# EAGLE board Muntjac (EAGLE 6.5.0)
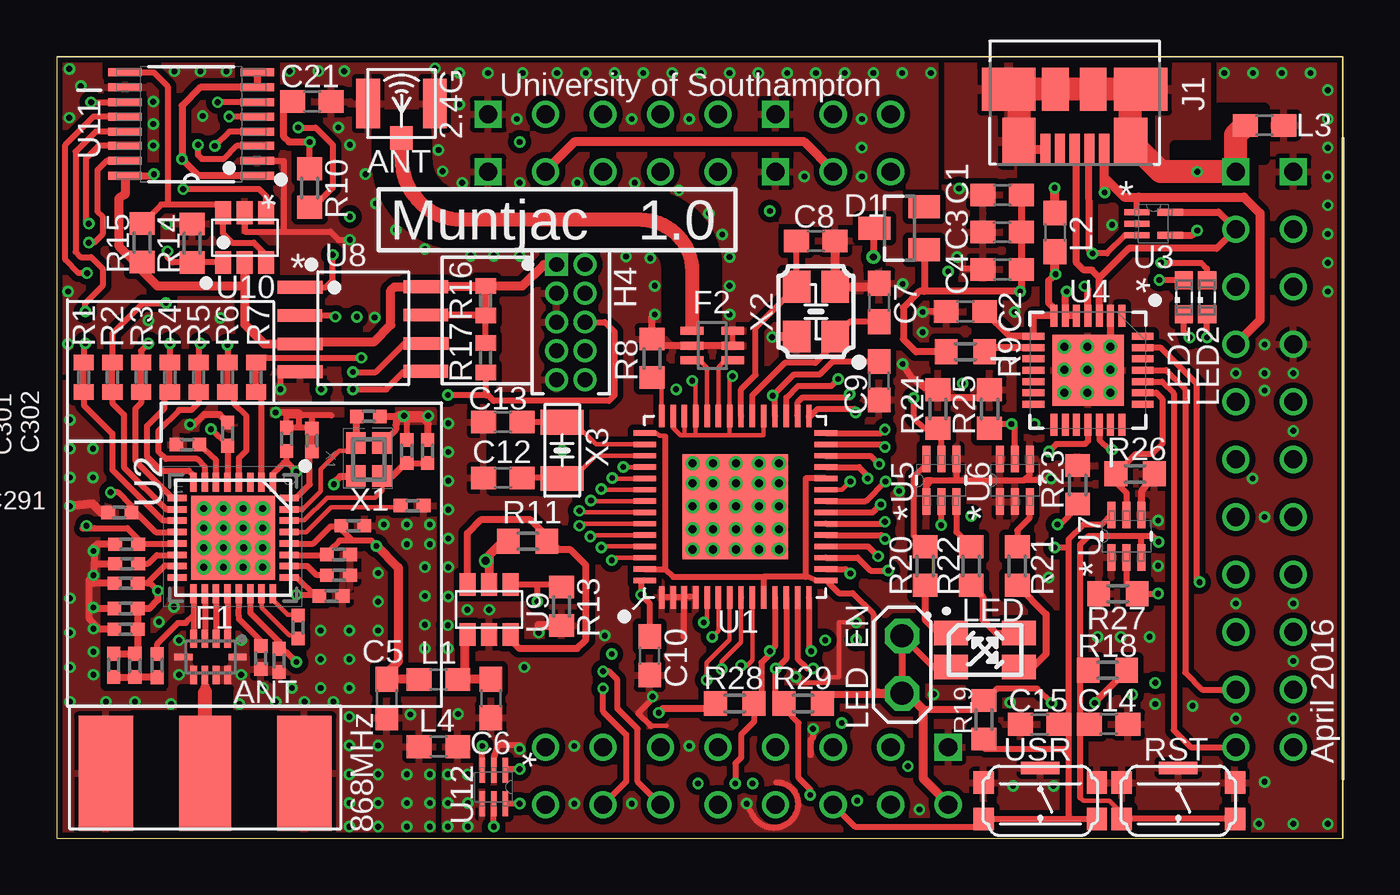
[diagram p6: board, top side]
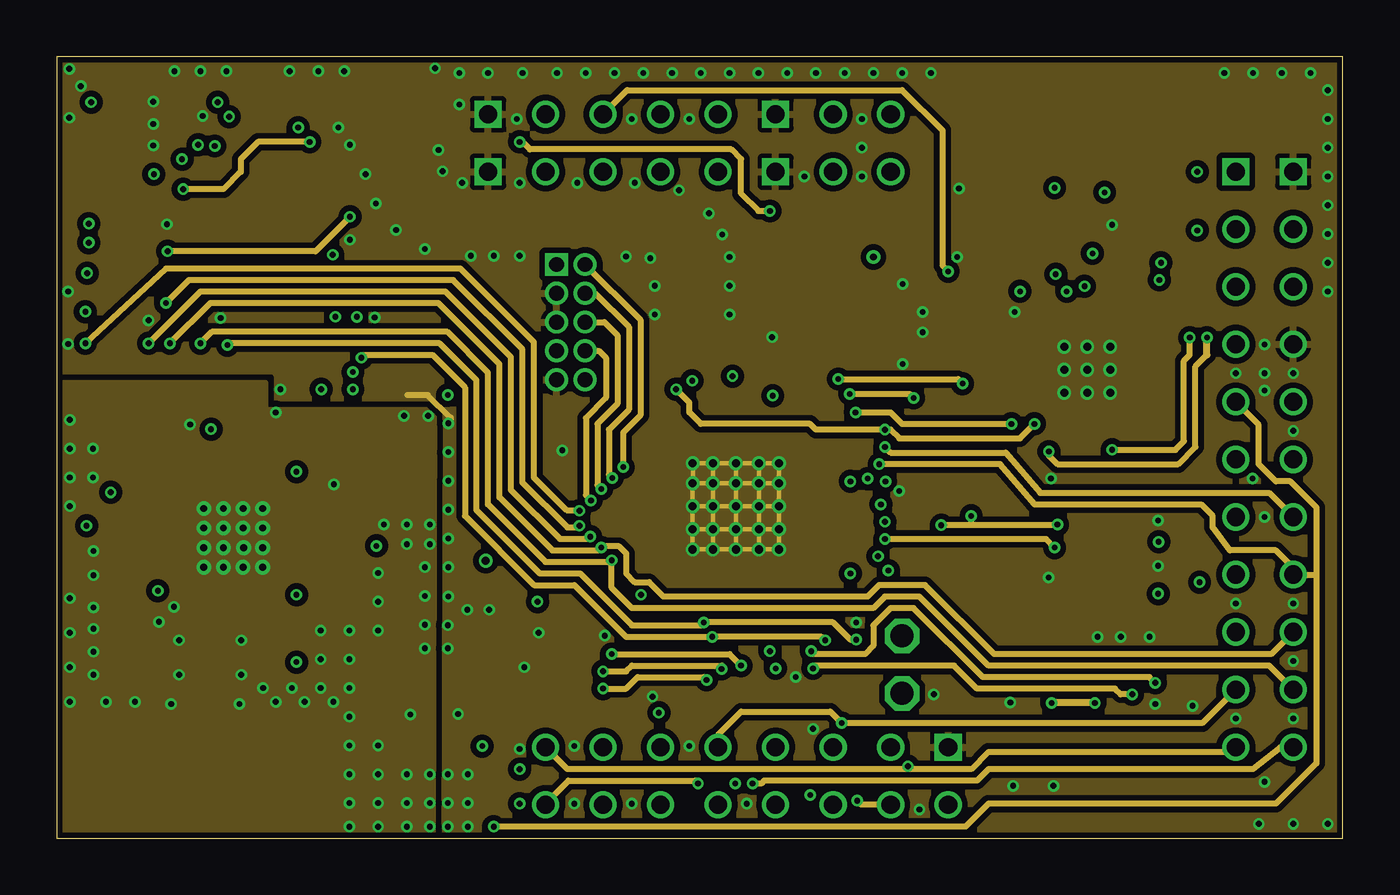
[diagram p7: board, inner layer Route2]
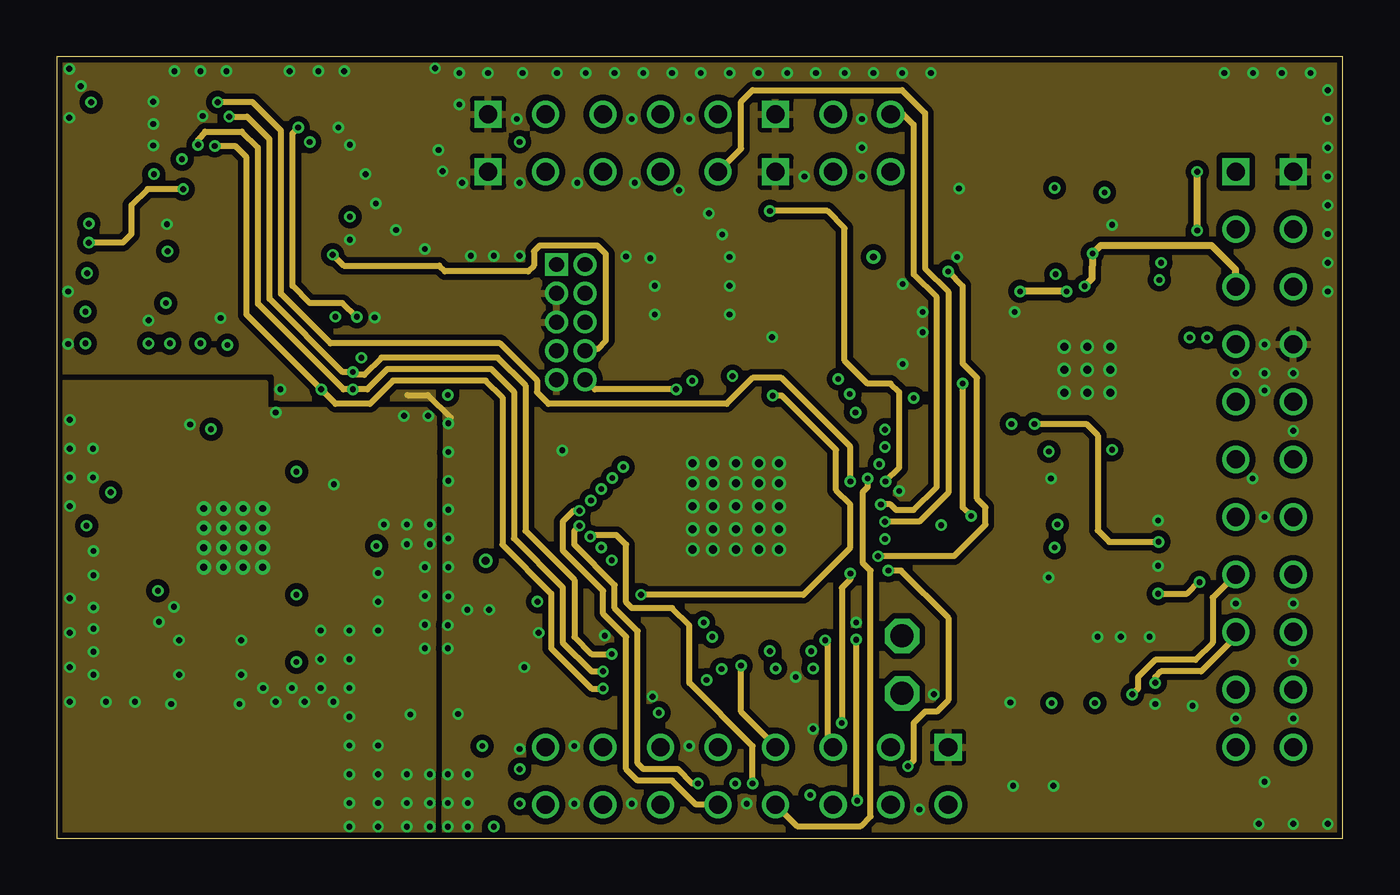
[diagram p8: board, inner layer Route3]
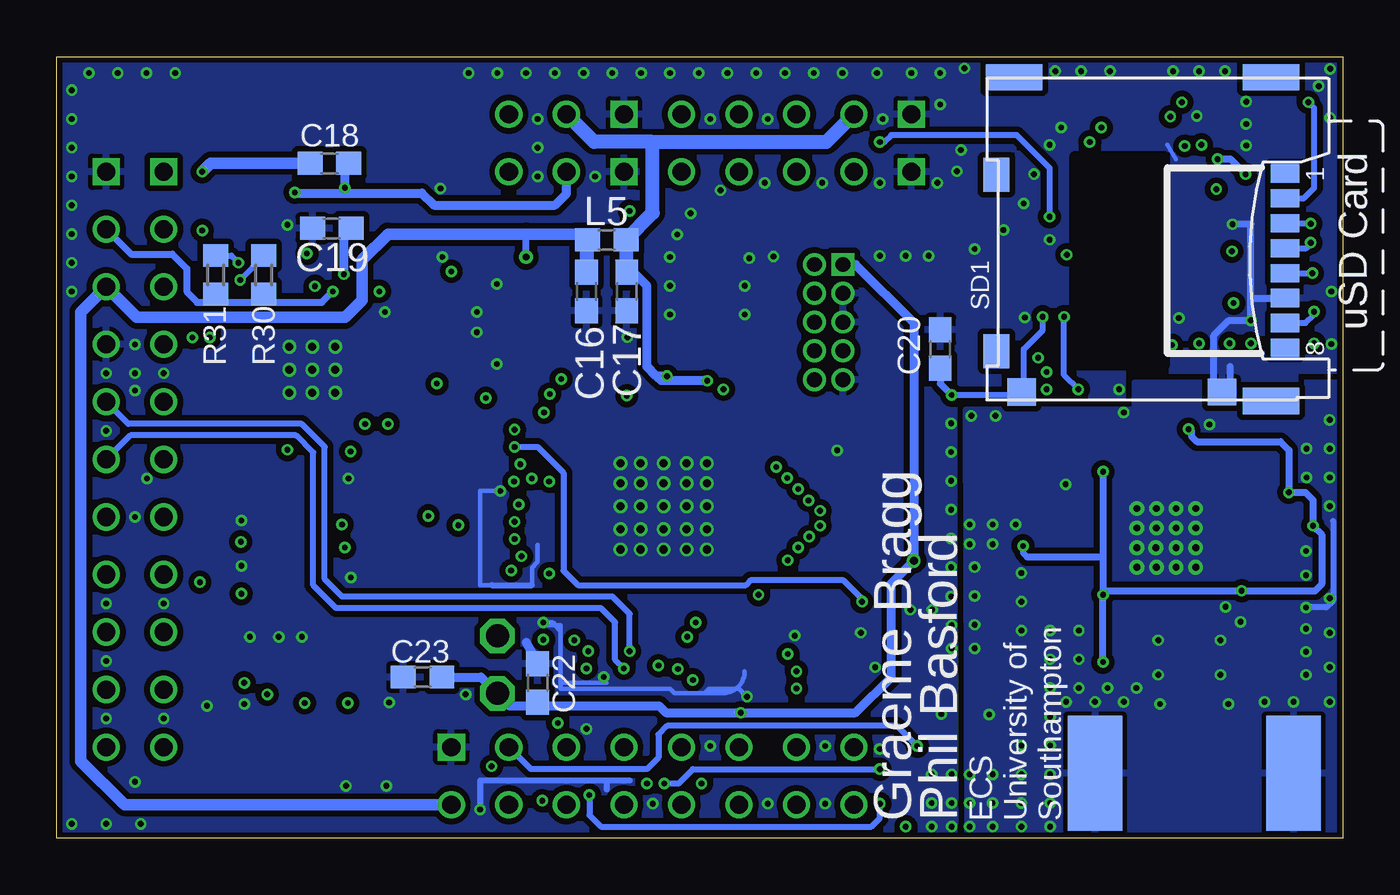
[diagram p9: board, bottom side, seen from below]

Size 56.8 x 34.5 mm. Coordinates in mm from the lower left corner, seen from the top.
Outline: 0,0 56.8,0 56.8,34.5 0,34.5 0,0
Copper layers (1+2*3+16): Top 0.035mm / dielectric 0.36mm / Route2 0.035mm / dielectric 0.71mm / Route3 0.035mm / dielectric 0.36mm / Bottom 0.035mm
Design rules "eC_4Layer_PClass6_BaseCopperO35-I35 *": minimum track width 0.15mm, minimum drill 0.25mm, track to track 0.15mm, track to pad 0.15mm, pad to pad 0.15mm, via to via 0.15mm, smd to smd 0.15mm, copper to edge 0.25mm, drill to drill 0.35mm, minimum pad ring 0.175mm, minimum via ring 0.125mm, stop-mask expansion 0mil, vias tented up to drill 0.45mm, thermal gap 0.2mm
tRestrict: area 2.2,10.7 to 4.6,13.4; area 9.7,14.8 to 11.5,17; area 12.2,15.2 to 14.7,18.3; area 9.4,16.6 to 12.2,18.3; area 14.7,15.2 to 16.8,18; area 5.9,8.4 to 7.7,10.5; area 2.2,6.8 to 3.9,10.7; area 3.9,6.8 to 4.7,8.5; area 42.7,29.2 to 48.3,34.3; area 49.4,28.1 to 52.8,30.6; area 51.3,30 to 53.3,32.2; area 27.2,11.8 to 32.8,17.4; 9 more areas; 5 lines
bRestrict: area 7.9,20.9 to 11.8,30.1

## Footprints (pad centres in the part's own frame; a part is rotated, then mirrored left to right if it is on the bottom)
UFL-HIROSE = smd 1.05 x 2.2: 1 -1.475,0; 2 1.475,0 | smd 1 x 1.05: RF 0,-1.525
JOHNSON_142-0701-806 = smd 2.413 x 5.08: 1 -4.381,-2.54; 2 4.381,-2.54 | smd 2.413 x 5.08 bottom: 3 4.381,-2.54; 4 -4.381,-2.54 | smd 2.286 x 5.08: RF 0,-2.54
C0603 = smd 1.1 x 1: 1 -0.85,0; 2 0.85,0
C0402_SMALL = smd 0.61 x 0.584: 1 -0.536,0; 2 0.485,0
SOT23 = smd 1 x 1.4: 1 -0.95,-1.1; 2 0.95,-1.1; 3 0,1.1
0900PC15J0013 = smd 0.3 x 0.8: 1 0.75,0.8; 2 0.25,0.8; 3 -0.25,0.8; 4 -0.75,0.8; 6 -0.75,-0.8; 7 -0.25,-0.8; 8 0.25,-0.8; 9 0.75,-0.8 | smd 0.8 x 0.3: 5 -1.2,0; 10 1.2,0
2450BM15A0015 = smd 0.35 x 1: 1 0.65,0.9; 2 0,0.9; 3 -0.65,0.9; 4 -0.65,-0.9; 5 0,-0.9; 6 0.65,-0.9
Z1 = drill 0.8 square: A1 17.78,-5.08; A2 17.78,-2.54; A11 30.48,-5.08; A12 30.48,-2.54; B17 50.8,-5.08; B18 53.34,-5.08; C39 38.1,-30.48 | drill 0.8: A3 20.32,-5.08; A4 20.32,-2.54; A5 22.86,-5.08; A6 22.86,-2.54; A7 25.4,-5.08; A8 25.4,-2.54; A9 27.94,-5.08; A10 27.94,-2.54; A13 33.02,-5.08; A14 33.02,-2.54; A15 35.56,-5.08; A16 35.56,-2.54; B19 50.8,-7.62; B20 53.34,-7.62; B21 50.8,-10.16; B22 53.34,-10.16; B23 50.8,-12.7; B24 53.34,-12.7; B25 50.8,-15.24; B26 53.34,-15.24; B27 50.8,-17.78; B28 53.34,-17.78; B29 50.8,-20.32; B30 53.34,-20.32; B31 50.8,-22.86; B32 53.34,-22.86; B33 50.8,-25.4; B34 53.34,-25.4; B35 50.8,-27.94; B36 53.34,-27.94; B37 50.8,-30.48; B40 53.34,-30.48; C40 38.1,-33.02; C41 35.56,-30.48; C42 35.56,-33.02; C43 33.02,-30.48; C44 33.02,-33.02; C45 30.48,-30.48; C46 30.48,-33.02; C47 27.94,-30.48; C48 27.94,-33.02; C49 25.4,-30.48; C50 25.4,-33.02; C51 22.86,-30.48; C52 22.86,-33.02; C53 20.32,-30.48; C54 20.32,-33.02
SAMTEC_FTS-105-01-L-D = drill 0.66 square: 1 -5.08,-1.27 | drill 0.66: 2 -5.08,0; 3 -3.81,-1.27; 4 -3.81,0; 5 -2.54,-1.27; 6 -2.54,0; 7 -1.27,-1.27; 8 -1.27,0; 9 0,-1.27; 10 0,0
MOLEX_47346-0001 = smd 0.45 x 1.38: 1 -1.3,0; 2 -0.65,0; 3 0,0; 4 0.65,0; 5 1.3,0 | smd 1.475 x 2.1: M1 -2.462,-0.36; M2 2.462,-0.36 | smd 2.375 x 1.9: M3 -2.913,-2.66; M6 2.913,-2.66 | smd 1.175 x 1.9: M4 -0.82,-2.66; M5 0.85,-2.66
PLCC-4_3.2X2.8 = smd 1.1 x 1.5: 1 -0.75,-1.5; 2 0.75,-1.5; 3 0.75,1.5; 4 -0.75,1.5
SML0603 = smd 0.8 x 0.8: A 0.75,0; C -0.75,0
1X02 = drill 1.016 octagon: 1 -1.27,0; 2 1.27,0
R0402 = smd 0.7 x 0.9: 1 -0.65,0; 2 0.65,0
R0603 = smd 1 x 1.1: 1 -0.85,0; 2 0.85,0
C&K-KMR-5MM = smd 0.9 x 1: 1 -2.5,-0.8; 2 -2.5,0.8; 4 2.5,0.8; 5 2.5,-0.8 | smd 1.7 x 0.55: 3 0,1.45
MICRO_SD-MOLEX_503182-0853 = smd 0.8 x 1.24: 1 0.4,-0.625; 2 1.5,-0.625; 3 2.6,-0.625; 4 3.7,-0.625; 5 4.8,-0.625; 6 5.9,-0.625; 7 7,-0.625; 8 8.1,-0.625 | smd 1.2 x 1.25: DETECT 10.045,-12.25 | smd 1.15 x 2.5: SHELL0 -3.845,-1.25; SHELL1 -3.845,-12.58; SHELL2 10.445,-1.25 | smd 1.5 x 1.15: SHELL3 0.46,-13.375; SHELL4 8.24,-13.375 | smd 1.16 x 1.25: SWITCH 10.045,-3.4
QFN56 = smd 1 x 0.24: 1 -4,3.25; 2 -4,2.75; 3 -4,2.25; 4 -4,1.75; 5 -4,1.25; 6 -4,0.75; 7 -4,0.25; 8 -4,-0.25; 9 -4,-0.75; 10 -4,-1.25; 11 -4,-1.75; 12 -4,-2.25; 13 -4,-2.75; 14 -4,-3.25; 29 4,-3.25; 30 4,-2.75; 31 4,-2.25; 32 4,-1.75; 33 4,-1.25; 34 4,-0.75; 35 4,-0.25; 36 4,0.25; 37 4,0.75; 38 4,1.25; 39 4,1.75; 40 4,2.25; 41 4,2.75; 42 4,3.25 | smd 0.24 x 1: 15 -3.25,-4; 16 -2.75,-4; 17 -2.25,-4; 18 -1.75,-4; 19 -1.25,-4; 20 -0.75,-4; 21 -0.25,-4; 22 0.25,-4; 23 0.75,-4; 24 1.25,-4; 25 1.75,-4; 26 2.25,-4; 27 2.75,-4; 28 3.25,-4; 43 3.25,4; 44 2.75,4; 45 2.25,4; 46 1.75,4; 47 1.25,4; 48 0.75,4; 49 0.25,4; 50 -0.25,4; 51 -0.75,4; 52 -1.25,4; 53 -1.75,4; 54 -2.25,4; 55 -2.75,4; 56 -3.25,4 | smd 4.65 x 4.65: PAD 0,0
RHM32_3P7X3P7 = smd 0.838 x 0.279: 1 -2.464,1.753; 2 -2.464,1.245; 3 -2.464,0.762; 4 -2.464,0.254; 5 -2.464,-0.254; 6 -2.464,-0.762; 7 -2.464,-1.245; 8 -2.464,-1.753; 17 2.464,-1.753; 18 2.464,-1.245; 19 2.464,-0.762; 20 2.464,-0.254; 21 2.464,0.254; 22 2.464,0.762; 23 2.464,1.245; 24 2.464,1.753 | smd 0.279 x 0.838: 9 -1.753,-2.464; 10 -1.245,-2.464; 11 -0.762,-2.464; 12 -0.254,-2.464; 13 0.254,-2.464; 14 0.762,-2.464; 15 1.245,-2.464; 16 1.753,-2.464; 25 1.753,2.464; 26 1.245,2.464; 27 0.762,2.464; 28 0.254,2.464; 29 -0.254,2.464; 30 -0.762,2.464; 31 -1.245,2.464; 32 -1.753,2.464 | smd 3.708 x 3.708: 33 0,0 | drill 0.305: V 1.295,1.295; V_2 -1.295,-0.432; V_3 -1.295,-1.295; V_4 -1.295,0.432; V_5 -1.295,1.295; V_6 -0.432,-1.295; V_7 -0.432,-0.432; V_8 -0.432,0.432; V_9 -0.432,1.295; V_10 0.432,-1.295; V_11 0.432,-0.432; V_12 0.432,0.457; V_13 0.432,1.295; V_14 1.295,-1.295; V_15 1.295,-0.432; V_16 1.295,0.432
SOT50P160X60-5N = smd 1.118 x 0.254: 1 -0.737,0.508; 2 -0.737,0; 3 -0.737,-0.508 | smd 1.118 x 0.305: 4 0.737,-0.508; 5 0.737,0.508
QFN50P500X500X100-29N = smd 0.965 x 0.305: 1 -2.413,1.499; 2 -2.413,0.991; 3 -2.413,0.508; 4 -2.413,0; 5 -2.413,-0.508; 6 -2.413,-0.991; 7 -2.413,-1.499; 15 2.413,-1.499; 16 2.413,-0.991; 17 2.413,-0.508; 18 2.413,0; 19 2.413,0.508; 20 2.413,0.991; 21 2.413,1.499 | smd 0.305 x 0.965: 8 -1.499,-2.413; 9 -0.991,-2.413; 10 -0.508,-2.413; 11 0,-2.413; 12 0.508,-2.413; 13 0.991,-2.413; 14 1.499,-2.413; 22 1.499,2.413; 23 0.991,2.413; 24 0.508,2.413; 25 0,2.413; 26 -0.508,2.413; 27 -0.991,2.413; 28 -1.499,2.413 | smd 3.15 x 3.15: 29 0,0
SOT65P210X110-6N = smd 1.168 x 0.356: 1 -0.94,0.66; 2 -0.94,0; 3 -0.94,-0.66; 4 0.94,-0.66; 5 0.94,0; 6 0.94,0.66
SOIC8 = smd 1.981 x 0.559: 1 -3.164,1.815; 2 -3.174,0.565; 3 -3.164,-0.685; 4 -3.164,-1.915; 5 2.384,-1.895; 6 2.404,-0.665; 7 2.384,0.585; 8 2.384,1.835
TSOT26 = smd 0.7 x 1: P$1 0.4,-1.9; P$2 1.35,-1.9; P$3 2.3,-1.9; P$4 2.3,0.3; P$5 1.35,0.3; P$6 0.4,0.3
SOP65P640X120-16N = smd 1.473 x 0.356: 1 -2.921,2.286; 2 -2.921,1.626; 3 -2.921,0.965; 4 -2.921,0.33; 5 -2.921,-0.33; 6 -2.921,-0.965; 7 -2.921,-1.626; 8 -2.921,-2.286; 9 2.921,-2.286; 10 2.921,-1.626; 11 2.921,-0.965; 12 2.921,-0.33; 13 2.921,0.33; 14 2.921,0.965; 15 2.921,1.626; 16 2.921,2.286
SOT50P160X60-6N = smd 1.118 x 0.254: 1 -0.737,0.508; 2 -0.737,0; 3 -0.737,-0.508; 4 0.737,-0.508; 5 0.737,0; 6 0.737,0.508
FA-128 = smd 0.95 x 0.85: 1 -0.725,-0.575; 2 0.725,-0.575; 3 0.725,0.575; 4 -0.725,0.575
XTAL-3.2X2.5 = smd 1.4 x 1.2: 1 -1.1,-0.85; 2 1.1,-0.85; 3 1.1,0.85; 4 -1.1,0.85
XTAL-3.2X1.5 = smd 1.092 x 1.905: 1 -1.245,0; 2 1.245,0

## Placement (x,y rotation side)
ANT  UFL  [UFL-HIROSE]  15.23,32.43 0 top
ANT_868  SMA  [JOHNSON_142-0701-806]  6.56,0.32 180 top
C1  4.7uF  [C0603]  41.76,28.4 180 top
C2  1uF  [C0603]  40.13,23.24 0 top
C3  1uF  [C0603]  41.76,26.76 180 top
C4  0.1uF  [C0603]  41.76,25.11 180 top
C5  100nf  [C0603]  14.58,6.17 270 top
C6  100nf  [C0603]  19.18,6.17 270 top
C7  47p  [C0603]  36.32,23.65 270 top
C8  47p  [C0603]  33.53,26.37 180 top
C9  1uF  [C0603]  36.32,20.19 90 top
C10  1uF  [C0603]  26.19,8.05 90 top
C11  47nF  [C0402_SMALL]  10.16,17.63 90 top
C12  47p  [C0603]  19.71,15.9 0 top
C13  47p  [C0603]  19.71,18.36 0 top
C14  1uF  [C0603]  46.46,5.03 0 top
C15  1uF  [C0603]  43.41,5.03 180 top
C16  100nf  [C0603]  33.4,24.13 270 bottom
C17  100nf  [C0603]  31.62,24.13 270 bottom
C18  100nf  [C0603]  44.75,29.79 180 bottom
C19  100nf  [C0603]  44.65,26.92 180 bottom
C20  1uF  [C0603]  17.78,21.59 90 bottom
C21  22uF  [C0603]  11.28,32.51 0 top
C22  1uF  [C0603]  35.56,6.86 270 bottom
C23  100nF  [C0603]  40.64,7.11 0 bottom
C51  47nF  [C0402_SMALL]  7.56,17.86 90 top
C61  220nF  [C0402_SMALL]  5.77,17.37 180 top
C121  47nF  [C0402_SMALL]  2.77,14.38 180 top
C131  47nF  [C0402_SMALL]  3.07,12.98 180 top
C151  47nF  [C0402_SMALL]  3.05,11.25 180 top
C171  10nF  [C0402_SMALL]  3.04,9.22 180 top
C172  100pF  [C0402_SMALL]  3.04,10.14 180 top
C173  33pF  [C0402_SMALL]  2.52,7.65 90 top
C211  10nF  [C0402_SMALL]  9.02,7.95 270 top
C221  47nF  [C0402_SMALL]  9.83,7.82 270 top
C231  1.8nF  [C0402_SMALL]  10.67,9.3 270 top
C251  47nF  [C0402_SMALL]  12.14,10.69 0 top
C261  47nF  [C0402_SMALL]  12.47,11.61 0 top
C271  47nF  [C0402_SMALL]  12.47,12.52 0 top
C281  47nF  [C0402_SMALL]  13.11,13.79 0 top
C291  47nF  [C0402_SMALL]  15.72,14.68 0 top
C301  15pF  [C0402_SMALL]  15.47,17.09 90 top
C302  DNP  [C0402_SMALL]  16.38,17.09 90 top
C311  15pF  [C0402_SMALL]  13.79,18.62 0 top
D1  BAT54S  [SOT23]  37.21,26.92 90 top
F1  0900PC15J0013  [0900PC15J0013]  6.8,8 0 top
F2  BALUN-2.4G  [2450BM15A0015]  28.96,21.74 90 top
H1  Z1  [Z1]  1.27,34.5 0 top
H4  FTS-105-01-L-D  [SAMTEC_FTS-105-01-L-D]  23.34,20.24 270 top
J1  [MOLEX_47346-0001]  44.96,30.4 180 top
L1  BEAD  [C0603]  16.87,7.01 180 top
L2  BEAD  [C0603]  44.08,26.75 270 top
L3  BEAD  [C0603]  53.34,31.46 0 top
L4  BEAD  [C0603]  16.87,4.04 0 top
L5  BEAD  [C0603]  32.51,26.42 180 bottom
L171  10n  [C0402_SMALL]  4.45,7.65 90 top
LED  [PLCC-4_3.2X2.8]  41,8.31 270 top
LED1  [SML0603]  49.78,23.88 90 top
LED2  [SML0603]  50.8,23.88 90 top
LED_EN  [1X02]  37.34,7.66 90 top
R1  DNP  [R0402]  1.2,20.35 270 top
R2  DNP  [R0402]  2.46,20.35 270 top
R3  DNP  [R0402]  3.73,20.35 270 top
R4  DNP  [R0402]  5,20.35 270 top
R5  DNP  [R0402]  6.27,20.35 270 top
R6  DNP  [R0402]  7.54,20.35 270 top
R7  DNP  [R0402]  8.81,20.35 270 top
R8  56k  [R0603]  26.29,21.18 90 top
R9  10k  [R0603]  40.13,21.47 180 top
R10  100k  [R0603]  11.18,28.7 90 top
R11  100K  [R0603]  20.8,13.11 180 top
R12  DNP  [C0402_SMALL]  11.28,17.55 270 top
R13  100K  [R0603]  22.3,10.24 90 top
R14  100K  [R0603]  5.99,26.26 270 top
R15  100K  [R0603]  3.78,26.29 270 top
R16  DNP  [R0402]  18.95,23.72 270 top
R17  DNP  [R0402]  18.95,21.21 270 top
R18  100k  [R0603]  46.41,7.42 0 top
R19  100k  [R0603]  40.94,5.23 90 top
R20  220  [R0603]  38.35,12.01 270 top
R21  220  [R0603]  42.42,12.01 270 top
R22  220  [R0603]  40.39,12.01 270 top
R23  4.7K  [R0603]  45.09,15.6 90 top
R24  4.7K  [R0603]  38.91,18.95 90 top
R25  4.7K  [R0603]  41.2,18.95 90 top
R26  4.7k  [R0603]  47.62,16.08 180 top
R27  4.7k  [R0603]  46.86,10.79 0 top
R28  10k  [R0603]  29.95,5.94 180 top
R29  10k  [R0603]  32.97,5.94 0 top
R30  1K5  [R0603]  47.65,24.87 270 bottom
R31  1K5  [R0603]  49.78,24.87 270 bottom
R141  56K  [C0402_SMALL]  3.12,12.12 0 top
R171  10  [C0402_SMALL]  3.46,7.6 270 top
RST  [C&K-KMR-5MM]  49.53,1.65 0 top
SD1  MICRO_SD-SPI-MOLEX_503182-0853  [MICRO_SD-MOLEX_503182-0853]  1.93,29.74 270 bottom
U1  CC2538  [QFN56]  29.97,14.63 90 top
U2  CC1120_RHM_32  [RHM32_3P7X3P7]  7.8,13.26 270 top
U3  TPD2E001IDRLRQ1  [SOT50P160X60-5N]  48.44,27.13 0 top
U4  CP2103  [QFN50P500X500X100-29N]  45.54,20.66 270 top
U5  BSS138PS  [SOT65P210X110-6N]  39.07,15.8 90 top
U6  BSS138PS  [SOT65P210X110-6N]  42.32,15.8 90 top
U7  BSS138PS  [SOT65P210X110-6N]  47.24,13.34 90 top
U8  M25P16VMN6P  [SOIC8]  13.92,22.5 0 top
U9  DMG6602SVT  [TSOT26]  20.45,9.3 180 top
U10  DMG6602SVT  [TSOT26]  6.96,27.3 0 top
U11  SN74AVC4T774PW  [SOP65P640X120-16N]  5.94,31.52 180 top
U12  TMP102AIDRLT  [SOT50P160X60-6N]  19.3,2.26 270 top
USR  [C&K-KMR-5MM]  43.43,1.65 0 top
X1  FA-128  [FA-128]  13.79,16.71 270 top
X2  32MHz  [XTAL-3.2X2.5]  33.53,23.24 90 top
X3  32.768K  [XTAL-3.2X1.5]  22.33,17.12 270 top

## Tracks (layer width: path | path; a pad name or v marks a point on that pad's centre or on a via)
2.4G
  Top 0.254: 28.07,22.53 28.07,22.4 arc-90 F2.1
  Top 0.305: F2.1
  Top 0.61: 28.07,22.53 28.07,25.02 arc90 25.78,27.3 17.91,27.3 arc-90 15.24,29.97 15.24,30.89 ANT.RF
32K_Q1
  Top 0.203: X3.2 22.78,15.88 23.8,16.89 U1.45 arc-90 U1.45
  Top 0.254: X3.2 22.3,15.9 C12.2
32K_Q2
  Top 0.203: U1.44 23.82,17.38 22.84,18.36 X3.1
  Top 0.254: X3.1 C13.2
32M_Q1
  Top 0.254: U1.34 30.72,19.55 32.16,20.98 33.5,20.98 34.38,21.86 X2.1 35.03,22.8 C7.2
32M_Q2
  Top 0.203: U1.35
  Top 0.254: U1.35 30.23,19.81 30.86,20.45 30.86,22.52 X2.3 C8.2
+3V3  (via drill 0.25, 0.3 pad 0.61, 0.36)
  Top 0.203: U1.43 26.49,17.88 26.62,17.75 26.85,17.75 arc-90 26.87,17.73 | U1.15 34.02,11.33 34.09,11.28
  Top 0.229: U1.15 33.5,11.38 33.07,11.58
  Top 0.254: U1.24 33.07,15.88 33.07,11.58 33.07,11.53 31.22,11.53 | 31.22,11.53 U1.10 | 34.09,11.28 34.54,10.82 35.15,10.82 36.07,9.91 36.07,6.39 | 37.34,8.94 38.72,7.56 LED.2 | v43.94,5.97 43.31,6.6 41.53,6.6 41.01,6.08 R19.2 | R15.2 3.91,25.55 | 8.31,25.73 U10.P$2 | R17.1 R16.2 | 26.87,17.73 26.87,11.88 | 31.22,11.53 27.22,11.53 26.87,11.88 | U1.55 26.87,11.88
  Top 0.305: U9.P$2 19.1,12.29 v18.95,12.24 19.1,12.24 | R11.2 19.61,13.01 | 37.34,8.94 LED_EN.1 | R19.2 40.53,5.66 38.28,5.66 | R18.2 45.85,6.01 v45.85,5.97 | R28.2 28.87,5.71 26.77,5.71 v26.59,5.54 | R29.2 arc90 33.92,5.84 33.91,5.84 33.93,6.34 33.93,6.35 36.03,6.35 arc90 36.07,6.39 | 36.07,26.88 v36.07,25.65 | 37.54,6.4 37.53,6.39 LED_EN.1 | LED_EN.1 | 18.56,24.34 R16.1 R16.2 18.36,23.09 U8.7 | U11.8 U11.7 6.35,33.15 5.54,32.33 v5.54,29.97 6.27,29.23 U11.1 | 11.56,21.89 11.43,21.82 U8.3 | 3.02,29.21 U11.16 4.34,29.23 v4.29,29.31
  Top 0.406: 19.61,13.01 19.1,12.49 U9.P$2 | H1.C40 39.41,1.48 38.28,2.62 38.28,5.66 37.54,6.4 | 36.27,6.4 LED_EN.1 | LED_EN.2 | LED_EN.2 37.34,8.94 | 18.56,24.34 U8.8 14.92,24.34 14.76,24.18 14.76,22.66 13.99,21.89 11.56,21.89 | H4.1 21.51,25.32 20.56,24.37 R16.1 | R15.2 3.44,25.44 2.74,26.14 2.74,28.25 3.02,28.42 3.02,29.21 | U10.P$2 8.31,24.38 | 8.31,24.38 8.31,22.68 9.17,21.82 U8.3 | 3.91,25.55 3.66,25.17 4.45,24.38 8.31,24.38 | 36.07,6.39 LED_EN.1
  Top 0.508: D1.3 36.07,26.88
  Route2 0.305: v45.85,5.97 v43.94,5.97
  Bottom 0.203: C22.2 35.56,5.84
  Bottom 0.305: v36.07,25.65 36.07,26.67 | LED_EN.1 | LED_EN.1 | v4.29,29.31 4.95,29.97 v5.54,29.97
  Bottom 0.406: LED_EN.1 36.78,5.84 35.56,5.84 30.2,5.84 29.9,5.54 v26.59,5.54 21.51,5.54 19.94,7.11 19.94,11.25 v18.95,12.24 18.95,22.76 21.51,25.32 H4.1 | L5.2 33.4,26.42 | C23.2 38.06,7.11 LED_EN.1
  Bottom 0.508: H1.C40 53.8,1.48 55.73,3.4 55.73,23.22 H1.B22 53.26,22.99 44.07,22.99 43.31,23.75 43.31,25.53 42.16,26.67 36.07,26.67 33.62,26.67 L5.2
  Bottom 0.61: 33.4,26.42 C16.1
+3V3_ANALOGUE  (via drill 0.25)
  Top 0.203: U1.33 31.22,17.78 29.72,17.78 | 29.72,17.78 28.22,17.78 | 28.22,17.78 U1.39 28.22,20.04 arc90 v28.07,20.19 | 29.72,17.78 U1.36 | U1.41 27.22,18.12 27.56,17.78 27.69,17.78 | 27.69,17.78 28.22,17.78 | U1.40 27.72,17.82 27.69,17.78 | v29.84,20.4 29.72,20.27 U1.36
  Bottom 0.406: 31.66,25.02 arc-90 C17.1 31.33,24.98 30.73,24.38 30.73,20.83 30.3,20.4 | v28.07,20.19 30.1,20.19 30.3,20.4 | v29.84,20.4 30.3,20.4
  Bottom 0.61: 31.66,25.02 L5.1 30.48,27.6 30.48,30.73 | 30.48,30.73 33.06,30.73 H1.A14 | 30.48,30.73 22.82,30.73 H1.A4
+3V3_SERIAL  (via drill 0.25)
  Top 0.305: C1.1 42.61,26.89 C3.1 42.6,25.49 C4.1 42.61,24.14 v42.55,24.14 38.31,24.14 | U4.5 U4.6 44.55,24.16 v44.6,24.14 | R9.2 37.95,21.47 37.39,22.03 37.39,23.42 38.11,24.14 38.31,24.14 | D1.1 38.31,24.14
  Route3 0.305: v44.6,24.14 v42.55,24.14
  Bottom 0.254: R31.2 49.78,23.65 | R30.2 47.5,23.86 47.5,23.65
  Bottom 0.305: H1.B20 53.51,25.78 51.69,25.78 51.05,25.15 51.05,24.13 50.6,23.65 49.78,23.65 47.5,23.65 45.09,23.65 v44.6,24.14
+5V  (via drill 0.25)
  Top 0.305: C2.2 42.1,22.16 U4.8 43.13,23.07 U4.7 44.04,23.4 43.81,23.62 43.81,24.61 44.1,24.89 v44.12,24.89
  Top 0.406: v44.12,24.89 44.08,24.9 L2.2
  Bottom 0.406: C19.1 44.12,26.61 v44.12,24.89
+5V_USB  (via drill 0.25)
  Top 0.254: U3.1 47.7,28.23 47.78,28.3
  Top 0.305: 46.26,29.19 46.25,29.19 46.25,29.22 | 46.25,28.61 46.25,28.48 46.26,28.48 v46.28,28.5 | L2.1 44.07,27.61
  Top 0.406: J1.1 46.26,29.19 47.14,28.3 47.78,28.3 52.43,28.3 53.14,27.59 53.14,22.87 H1.B23 | v44.07,28.71 44.07,27.61 | 46.25,29.22 46.25,28.61 | H1.A3 21.59,29.46 22.86,30.73 33.02,30.73 34.29,29.46 H1.A13
  Bottom 0.305: v46.28,28.5 46.15,28.48 | 44.07,29.7 C18.1
  Bottom 0.406: H1.A13 34.29,28.45 34.8,27.94 40.13,27.94 40.67,28.48 44.07,28.48 | 46.15,28.48 44.07,28.48 | 44.07,28.48 v44.07,28.71 44.07,29.7
ADC_SENSORS_ADC1  (via drill 0.25)
  Top 0.254: U1.21 36.05,14.38 v36.4,14.73
  Route3 0.254: v36.4,14.73 36.83,14.73 37.08,14.48 37.85,14.48 38.86,15.49 38.86,23.88 37.85,24.89 37.85,31.5 37.38,31.96 H1.A16
ADC_SENSORS_ADC2  (via drill 0.25)
  Top 0.254: U1.20 36.49,13.88 v36.58,13.97
  Route3 0.254: H1.A9 30.23,30.44 30.23,32.51 30.73,33.02 37.34,33.02 38.35,32 38.35,25.15 39.37,24.13 39.37,15.24 38.1,13.97 v36.58,13.97
ADC_SENSORS_ADC3  (via drill 0.25)
  Top 0.254: U1.18 35.84,12.88 v36.27,12.45
  Route2 0.254: H1.A6 25.19,33.02 37.34,33.02 39.12,31.24 39.12,25.27 v39.37,25.02
  Route3 0.254: v39.37,25.02 40.01,24.38 40.01,20.95 40.64,20.32 40.64,14.99 41.02,14.61 41.02,13.84 39.62,12.45 v36.27,12.45
BSL_DTR  (via drill 0.25)
  Top 0.254: v48.64,10.79 R27.2 47.24,11.26 U7.2 | v50.47,11.3 50.34,11.3 50.34,20.07 48.76,21.65 U4.27
  Route3 0.254: v48.64,10.79 49.91,10.79 50.47,11.35 v50.47,11.3
BSL_RTS
  Top 0.254: U4.23 48.56,19.67 48.82,19.41 48.82,17.4 48.39,16.97 47.66,16.97 R26.2 46.77,15.71 47.24,15.24 U7.5
CC2538_NRESET  (via drill 0.25)
  Top 0.203: 45.19,1.8 45.34,1.65 46.48,1.65 47.03,1.1
  Top 0.254: U7.3 47.9,13.34 | 47.9,13.34 45.56,13.34 45.19,12.96 45.19,7.37 | 45.19,7.37 45.19,5.05 | 45.19,5.05 45.19,1.8 | 47.03,1.1 RST.1 RST.5 52.25,0.64 | C14.1 45.19,5.05 | U1.28 36.42,17.88 v36.58,18.03 | v48.67,13.08 48.39,13.34 47.9,13.34 | R18.1 45.51,7.37 45.19,7.37
  Route2 0.254: v27.36,19.81 27.94,19.23 27.94,18.8 28.45,18.29 33.27,18.29 33.53,18.03 v36.58,18.03 36.83,18.03 37.21,17.65 42.55,17.65 v43.18,18.29
  Route3 0.254: v27.36,19.81 23.77,19.81 H4.10 | v43.18,18.29 45.47,18.29 45.97,17.78 45.97,13.59 46.48,13.08 v48.67,13.08
DCOUPL  (via drill 0.25)
  Top 0.254: U1.32 31.72,19.63 | U1.56 25.81,11.37 v25.81,10.74 26.19,10.36 C10.2 | C9.2 36.44,21.06 34.29,21.06 33.71,20.47 32.56,20.47 31.72,19.63 | 31.72,19.63 v31.62,19.53
  Route3 0.254: v25.81,10.74 32.97,10.74 35.05,12.82 35.05,14.73 34.42,15.37 34.42,17.14 32.03,19.53 v31.62,19.53
GND  (via drill 0.25, 0.36)
  Top 0.203: F2.5 F2.6 | v29.99,14.65 U1.PAD | v35.31,9.53 34.54,9.53 34.54,7.11 34.04,7.11 34.04,6.86 32.77,6.86 32.77,7.11 | 26.92,4.95 26.24,4.95
  Top 0.254: U5.4 39.73,15.8 | 38.66,15.8 38.41,15.54 U5.1 | 38.66,15.8 39.73,15.8 | 38.66,15.8 38.38,15.8 38.38,15.29 | 39.73,15.8 42.72,15.8 | 42.72,15.8 42.98,16.05 U6.4 | 43.92,15.8 42.72,15.8 | R14.1 6.36,26.75 | U10.P$5 8.31,26.77 10.03,26.77 | U8.4 9.88,20.59 v9.88,19.81 | U1.1 26.76,10.67 27.69,10.67 | 28.19,10.67 27.69,10.67 | 27.69,10.67 27.69,8.89 | 10.03,26.77 12.09,26.77 12.45,26.42 v12.95,26.42 | U11.2 10.03,29.9 10.03,26.77 | v20.45,3.94 20.45,4.12 19.56,4.12 19.43,3.94 19.3,3.56 U12.2 | 31.77,2.46 31.8,2.46 arc-90 32.74,1.52 arc-152 30.73,1.02 arc-4 v30.48,1.52 | 40.01,25.15 40.89,25.15 40.91,25.13 C4.2 | 26.24,4.95 25.68,5.51 26.31,6.15 v26.31,6.25 | 33.27,3.68 33.27,4.32 33.4,4.45 v33.4,4.83 | 33.3,4.32 33.3,3.68
  Top 0.305: F2.5 F2.2 | U4.2 v46.53,21.69 | 46.53,21.65 U4.29 | v44.49,21.7 v44.49,20.68 | v44.49,20.68 v44.49,19.67 v45.51,19.67 v46.53,19.67 | v45.51,20.68 v44.49,20.68 | v45.51,20.68 45.51,19.81 45.47,19.77 | 45.47,19.51 45.47,19.77 | 45.47,19.77 45.61,19.77 v46.53,20.68 | v45.51,20.68 v45.51,21.7 45.56,21.65 46.53,21.65 | 46.53,21.65 v46.53,21.69 | v46.53,21.69 v46.53,21.7 | C2.1 38.17,23.27 v38.25,23.22 | R26.1 47.9,15.3 U7.4 | R25.2 40.83,19.43 39.28,19.43 R24.2 38.33,19.89 38.1,20.07 | 38.1,20.07 37.74,20.34 v37.36,20.94 | 38.61,20.07 38.1,20.07 | 28.04,21.74 26.29,21.74 26.29,23.01
  Top 0.406: C8.1 X2.2 36.17,24.34 arc90 C7.1 | X2.4 31.61,22.14 arc90 v31.59,22.12 | R13.1 21.29,9.39 v21.29,9.07
  Route2 0.203: v28.09,16.55 v28.98,16.55 | v28.98,16.55 v29.99,16.55 | v29.99,16.55 v31.01,16.55 | v31.01,16.55 v31.9,16.55 v31.9,15.66 | v31.9,15.66 v31.9,14.65 | v31.9,14.65 v31.9,13.63 | v31.9,13.63 v31.9,12.74 v31.01,12.74 | v31.01,12.74 v29.99,12.74 | v29.99,12.74 v28.98,12.74 | v28.98,12.74 v28.09,12.74 v28.09,13.63 | v28.09,13.63 v28.09,14.65 | v28.09,14.65 v28.09,15.66 v31.9,15.66 | v28.09,14.65 v31.9,14.65 | v28.09,13.63 v31.9,13.63 | v29.99,12.74 v29.99,15.66 v29.99,16.55 | v28.98,12.74 v28.98,15.66 v28.98,16.55 | v31.01,12.74 v31.01,15.66 v31.01,16.55 | v29.99,16.55 v28.09,16.55 v28.09,15.67
  Route2 0.254: 15.49,19.56 16.38,19.56 17.4,18.57 17.4,18.41
  Route3 0.254: 15.49,19.56 16.38,19.56 17.4,18.57
  Bottom 0.203: 35.81,11.18 35.81,11.94 35.56,12.19 35.56,12.95 | 28.19,6.4 29.52,6.4 29.72,6.6 34.54,6.6 34.54,6.86 | 28.19,6.4 27.99,6.6 26.67,6.6 26.36,6.27 v26.31,6.25 | 34.8,9.4 35.18,9.4 v35.31,9.53 34.92,9.53 arc90 34.8,9.4 | 34.8,9.4 34.54,9.14 | 34.54,9.14 34.54,6.86 | 28.19,6.4 27.38,6.4 arc-90 26.42,7.37 | 34.8,9.4 34.54,9.4 34.54,9.14 | 34.54,6.86 32.77,6.86 | 32.51,6.86 32.77,6.86 | 32.77,6.86 32.77,7.11 | 37.21,15.34 38.1,15.34 38.1,11.18 37.59,11.18 | 7.75,30.61 7.37,29.97
  Bottom 0.254: 37.59,11.18 35.81,11.18 | 31.5,2.54 32.51,2.54 | 32.51,2.54 38.1,2.54 v38.1,1.27 | 32.51,2.54 32.51,2.16
  Bottom 0.305: 5.69,19.7 5.69,22.2 5.03,22.86 v4.06,22.86 4.06,23.88 | SD1.6 4.03,23.84 arc90 4.06,23.88 | 4.06,23.88 4.06,27.1 v4.88,27.1 | 4.98,19.56 4.98,20.83
  Bottom 0.406: 5.59,19.7 5.69,19.7 | 36.07,8.64 35.56,7.75
  Bottom 0.61: SD1.SWITCH 5.59,19.7
  other vias: 17.73,5.49 17.27,1.55 19.1,10.08 28.98,13.63 28.98,14.65 31.01,14.65 31.01,13.63 29.99,13.63 38.25,22.33 48.63,14.03 48.63,12.02 20.65,7.54 18.14,10.08 43.81,11.51 43.91,15.88 42.11,5.99 42.24,2.31 42.31,23.22 20.45,28.93 22.99,28.93 25.53,28.93 16.87,30.38 27.48,28.6 17.04,29.44 26.42,24.38 26.42,23.11 26.21,25.6 25.15,25.68 20.45,25.7 19.05,33.78 22.1,33.78 24.64,33.78 27.18,33.78 29.72,33.78 32.26,33.78 34.8,33.78 37.34,33.78 38.61,33.78 36.07,33.78 33.53,33.78 30.99,33.78 28.45,33.78 25.91,33.78 23.37,33.78 20.57,33.78 12.95,30.61 51.56,33.78 52.83,33.78 54.1,33.78 55.37,33.78 46.61,27.08 56.13,26.67 56.13,27.94 56.13,29.21 56.13,30.48 56.13,25.4 56.13,31.75 56.13,33.02 35.56,31.75 35.56,30.48 35.56,29.21 33.02,29.21 25.4,31.75 27.94,31.75 20.32,31.75 25.4,1.52 22.86,1.52 22.86,4.06 56.13,0.64 53.09,0.64 54.61,0.64 50.16,5.84 48.26,8.89 46.99,8.89 45.97,8.89 52.07,20.52 53.34,20.52 54.61,20.52 53.34,21.79 53.34,19.76 54.61,17.98 53.34,14.17 54.61,10.36 52.07,10.36 54.61,7.82 52.07,5.28 54.61,5.28 48.51,5.92 39.77,25.66 39.85,28.68 29.72,23.11 29.72,24.38 29.72,25.65 28.8,27.58 29.39,26.64 16.71,33.99 17.78,32.38 12.7,33.86 14.1,28.02 16.26,26.01 38.73,6.35 1.07,33.2 4.27,31.52 4.27,30.58 4.27,32.51 6.45,31.88 17.27,2.82 17.27,0.51 18.16,2.82 18.16,0.51 18.16,1.55 14.99,26.85 18.29,25.7 19.3,25.7 24.21,8.94 37.2,15.32 22.33,17.12 32.64,7.11 0.51,24.13 0.51,21.82 7.24,22.96 14.05,22.99 27.94,4.06 44.02,2.31 53.34,2.49 52.81,15.88 56.13,24.13 17.78,33.78 10.29,33.86 11.56,33.86 0.56,33.96 0.56,31.8 7.49,33.86 5.21,33.86 6.35,33.86 17.3,11.96 17.27,8.38 17.27,9.4 17.3,10.67 17.3,13.23 17.3,14.5 17.3,15.77 17.3,17.04 17.3,18.31 37.36,24.47 13.64,29.31 17.91,28.93 12.45,31.37
  pour Bottom (isolate 0.254, rank 4): -10.16,43.69 -10.16,-2.29 62.99,-2.29 62.99,43.69 -9.91,43.69
  pour Route2 (isolate 0.254, rank 4): -12.7,41.15 -12.7,-4.83 60.45,-4.83 60.45,41.15 -12.45,41.15
  pour Top (isolate 0.254, rank 4): -13.97,39.88 -13.97,-6.1 59.18,-6.1 59.18,39.88 -13.72,39.88
  pour Route3 (isolate 0.254, rank 4): -11.43,42.42 -11.43,-3.56 61.72,-3.56 61.72,42.42 -11.18,42.42
  pour Top (isolate 0.254): 30.23,4.06 30.23,1.78 33.02,1.78 33.02,2.79 31.75,4.06
GNDA  (via drill 0.25)
  Top 0.305: U3.4 50.16,26.62 v50.37,26.83 | J1.M2
  Top 0.406: J1.5 42.85,30.4 arc-90 J1.M2
  Top 1.016: J1.M2 42.49,32.61 J1.M6 J1.M5 J1.M4 J1.M3 47.42,32.61 J1.M1 48.76,29.42 v50.37,29.42 H1.B17 52.07,31.04 L3.1
  Route3 0.305: v50.37,26.83 v50.37,29.42
  Bottom 0.508: C18.2 49.99,29.79 v50.37,29.42
  pour Top (isolate 0.254): 39.37,29.21 50.8,29.21 50.8,35.56 39.37,35.56
I2C_SCL  (via drill 0.25)
  Top 0.254: U1.11 31.72,8.48 v31.5,8.26 31.5,8.13 31.11,7.75 31.11,5.84 R28.1 30.8,5.14 30.23,4.57 30.23,3.56 29.97,3.3 v29.97,2.41 | v20.45,3.05 19.86,3.05 U12.1
  Bottom 0.254: v31.5,8.26 31.5,9.91 32.26,10.67 44.2,10.67 44.96,11.43 44.96,17.27 45.97,18.29 53.64,18.29 H1.B26 | v20.45,3.05 28.7,3.05 29.34,2.41 v29.97,2.41
I2C_SDA  (via drill 0.25)
  Top 0.254: U1.12 32.22,7.91 31.8,7.49 v31.75,7.49 | 31.66,7.41 v31.75,7.49 | v31.75,7.49 31.75,5.84 R29.1 32.12,5.73 32.77,5.08 32.77,2.67 33.27,2.16 v33.27,1.91 | v20.45,1.52 U12.6
  Bottom 0.254: v31.75,7.49 32.13,7.87 32.13,9.53 32.77,10.16 44.45,10.16 45.47,11.18 45.47,17.02 46.23,17.78 53.55,17.78 H1.B28 | v33.27,1.91 33.27,1.02 32.77,0.51 20.83,0.51 20.45,0.89 v20.45,1.52
JTAG_TCK  (via drill 0.25)
  Top 0.203: U1.47 24.54,15.88 arc-90 v24.54,15.9
  Route2 0.254: H4.4 23.79,24.05 25.27,22.57 25.27,18.92 24.38,18.03 24.38,16.05 v24.54,15.9
JTAG_TDI/FLASH_SPI_CSN  (via drill 0.25)
  Top 0.203: U1.49 23.65,14.88
  Top 0.254: 23.65,14.88 v23.6,14.91 | U8.1 11.87,24.32 12.19,24.64 v12.19,25.76
  Route2 0.254: H4.8 23.95,21.51 24.26,21.21 24.26,19.43 23.37,18.54 23.37,15.14 v23.6,14.91
  Route3 0.254: H4.8 23.42,21.59 23.88,21.59 24.26,21.97 24.26,25.78 23.88,26.16 21.34,26.16 21.08,25.91 21.08,25.27 20.83,25.02 17.14,25.02 16.89,25.27 12.68,25.27 v12.19,25.76
JTAG_TDO/SD_PRESENCE  (via drill 0.25)
  Top 0.203: U1.48 24.13,15.38
  Top 0.254: 24.13,15.38 v24.05,15.42 | H4.6 24.21,22.78 24.64,22.35 24.64,19.56 24.38,19.3 19.3,19.3 19.05,19.56 18.95,19.56 | 18.95,19.56 v17.27,19.56 | R17.2 18.95,19.56 | v10.67,31.37 11.43,31.37 12.19,30.61 12.19,28.7 11.68,28.19 11.52,28.19 R10.1
  Route2 0.254: H4.6 24.19,22.78 24.77,22.21 24.77,19.18 23.88,18.29 23.88,15.6 v24.05,15.42
  Route3 0.254: v13.26,23.01 12.62,23.62 11.18,23.62 10.41,24.38 10.41,31.11 v10.67,31.37
  Bottom 0.254: v17.27,19.56 14.29,19.56 SD1.DETECT 14.19,19.68 14.1,19.94 14.1,21.59 13.26,22.43 v13.26,23.01
  Bottom 0.305: C20.1 17.78,20.07 v17.27,19.56
JTAG_TMS  (via drill 0.25)
  Top 0.203: U1.46 v25.02,16.38
  Top 0.254: v25.02,16.38
  Route2 0.254: H4.2 25.78,22.89 25.78,18.67 25.02,17.91 v25.02,16.38
LEDS_BLUE  (via drill 0.25)
  Top 0.254: U1.29 33.22,18.57 33.6,18.95 35.26,18.95 v35.28,18.8 | R25.1 41.39,18.29 v42.16,18.29 42.32,18.14 U6.5
  Route2 0.254: v35.28,18.8 36.83,18.8 37.34,18.29 v42.16,18.29
LEDS_GREEN  (via drill 0.25)
  Top 0.254: U1.30 32.72,19.23 32.94,19.46 35.03,19.46 v35.03,19.61 | U5.5 39.06,17.95 R24.1 38.29,18.1 37.85,18.54 v37.85,19.43
  Route2 0.254: v35.03,19.61 37.67,19.61 v37.85,19.43
LEDS_RED  (via drill 0.25)
  Top 0.254: U1.31 32.22,19.45 32.74,19.96 34.21,19.96 v34.52,20.27 | v39.06,13.82 U5.2 | R23.1 45.09,14.61 44.32,13.84 v44.2,13.84
  Route2 0.254: v34.52,20.27 39.8,20.27 v40.01,20.07 | 40.39,14.12 v40.39,14.22 40.39,13.82 | 40.39,13.82 v39.06,13.82 | v44.2,13.84 arc90 44.09,13.82 40.39,13.82
  Route3 0.254: v40.01,20.07 40.01,14.61 v40.39,14.22
MEM_VCC  (via drill 0.25)
  Top 0.254: U11.15 2.21,29.9 1.8,29.49 1.8,27.66 2.03,27.43 2.03,26.67 1.65,26.29 v1.42,26.29 | U10.P$4 9.26,28.33 8.94,28.65 v5.59,28.65 | R10.2 v11.18,30.73
  Top 0.305: C21.1 10.01,32.51 10.01,30.99 10.26,30.73 v11.18,30.73
  Route2 0.254: v11.18,30.73 8.89,30.73 8.13,29.97 8.13,29.41 7.37,28.65 v5.59,28.65
  Route3 0.254: v5.59,28.65 4.01,28.65 3.3,27.94 3.3,26.67 2.92,26.29 v1.42,26.29
  Bottom 0.254: SD1.4 1.61,26.04 1.42,26.23 v1.42,26.29
N$1
  Top 0.203: 9.55,10.51 10.21,9.86 10.67,9.86
  Top 0.254: 9.55,10.51 U2.24 | 10.67,9.86 C231.1
N$2
  Top 0.203: 10.67,8.84 10.54,8.84 | 9.05,10.51 9.06,10.3 9.06,10.18 10.27,8.97 10.51,8.97 C231.2
  Top 0.254: 9.05,10.51 9.04,10.52 U2.23 | C231.2 10.64,8.84 10.54,8.84
N$3
  Top 0.254: U2.21 8.05,10.46 8.05,9.81 8.05,9.68 8.99,8.73 C211.1
N$4
  Top 0.254: U2.6 7.04,16.7 C61.1
N$5
  Top 0.254: C261.1 11.48,11.61 11.07,12.01 U2.26
N$6
  Top 0.203: 13.22,17.41 13.22,17.09 12.47,17.09 11.66,16.28 11.66,15.32 10.86,14.52 10.82,14.52
  Top 0.254: 10.82,14.52 10.56,14.5 U2.31 | X1.1 13.26,17.44 13.26,17.5 | C311.1 13.26,18.59
  Top 0.304: 13.22,17.41 13.26,17.41 13.26,17.5 13.26,18.59
N$7
  Top 0.203: 10.54,14.03 10.57,14.03 10.94,14.03 11.94,15.04 14.07,15.04 14.4,15.37 14.4,15.98
  Top 0.254: 10.54,14.03 U2.30 | X1.3 14.35,15.99 14.35,15.98 | C302.1 C301.1 15.39,16.56
  Top 0.304: 15.39,16.56 14.81,15.98 14.4,15.98 14.35,15.98 14.34,15.99
N$8
  Top 0.203: 15.11,14.61 12.12,14.61 11.02,13.51 10.59,13.51 10.54,13.5 U2.29
  Top 0.254: 15.11,14.61 15.16,14.66 15.19,14.66 C291.1 | U2.29
N$9
  Top 0.254: U2.20 F1.1
N$10
  Top 0.254: U2.19 7.04,8.82 F1.2
N$11
  Top 0.254: 6.55,6.83 6.38,6.45 6.73,6.45 6.58,6.78 | 6.55,6.4 6.55,7.06 | ANT_868.RF 6.55,2.9
  Top 0.305: 6.55,6.83 6.55,7.06 F1.7
  Top 0.61: 6.55,2.9 6.55,6.4
N$12
  Top 0.254: U2.18 F1.3
N$13
  Top 0.254: R141.2 4.04,12.12 4.42,12.5 U2.14
N$14
  Top 0.254: 6.05,9.84 U2.17 6.04,10.44 | 6.05,9.84 F1.4 | L171.2 4.45,8.59 5.36,9.5 5.71,9.5 6.05,9.84
N$15  (via drill 0.25)
  Top 0.254: U4.19 46.05,17.58 46.48,17.14 v46.61,17.14 | v50.04,22.1 49.78,22.35 LED1.C
  Route2 0.254: v46.61,17.14 49.4,17.14 49.78,17.53 49.78,21.08 50.04,21.34 v50.04,22.1
N$17  (via drill 0.25)
  Top 0.254: U4.18 45.54,17.53 45.41,17.4 44.15,17.4 v43.81,17.07 | v50.8,22.1 LED2.C
  Route2 0.254: v43.81,17.07 43.81,16.89 44.2,16.51 49.53,16.51 50.29,17.27 50.29,20.83 50.8,21.34
  Route2 0.305: 50.8,21.34 v50.8,22.1
N$19
  Top 0.254: R171.2
  Top 0.305: 3.64,7.11 R171.2 C173.1 | L171.1 R171.2
N$20  (via drill 0.25)
  Top 0.254: LED1.A 48.7,24.63 v48.69,24.64
  Bottom 0.254: 47.56,25.72 R30.1 47.65,25.68 v48.69,24.64
N$21
  Top 0.203: 26.72,18.78 U1.42 26.72,20 R8.1
N$22
  Top 0.254: 39.41,9.14 LED.1
  Top 0.305: R20.2 38.35,9.65 38.95,9.06 LED.1
N$23
  Top 0.305: 42.35,7.56 LED.3 43.12,7.56 43.69,8.13 43.69,9.89 R21.2
N$24
  Top 0.305: R22.2 40.89,10.66 40.89,9.65 41.49,9.06 LED.4
N$25
  Top 0.254: U5.6 38.41,16.51 37.85,15.95 37.85,13.37 R20.1
N$27
  Top 0.305: U4.9 41.24,21.65 R9.1
N$28
  Top 0.203: U1.37 29.22,20.79 29.5,21.07 29.86,21.07 F2.4
N$29
  Top 0.203: U1.38 28.72,20.76 28.39,21.09 F2.3
N$31
  Top 0.254: L1.1 17.72,7.05 18.03,7.37 | 18.03,8.88 U9.P$4
  Top 0.305: C6.1 19.16,7.01 | 18.15,8.88 U9.P$4
  Top 0.406: 19.16,7.01 L1.1 | 18.03,7.37 18.03,8.88
N$32
  Top 0.254: R21.1 42.42,13.59 42.98,14.15 U6.3
N$33
  Top 0.254: U5.3 39.73,13.53 R22.1
N$34
  Top 0.305: U9.P$6 20.19,8.61 20.42,8.38 22.99,8.38 23.37,8.76 23.37,12.05 22.67,12.75 22.16,12.75 R11.1 21.65,13.32 20.93,14.05 18.73,14.05 18.15,13.46 U9.P$3
N$40  (via drill 0.25)
  Top 0.254: v48.77,25.4 50.55,25.4 50.8,25.15 LED2.A
  Bottom 0.254: 49.59,25.72 R31.1 49.09,25.72 v48.77,25.4
N$42
  Top 0.254: 4.13,27.39 R15.1 4.61,27.96 4.9,27.96 | U10.P$6 7.36,27.96 4.9,27.96 | U10.P$6 7.36,27.29 | U10.P$3 9.26,25.74 8.71,26.29 7.75,26.29 7.36,26.68 U10.P$6 | U11.9 4.29,33.81 4.9,33.2 4.9,27.96
PWR_MEM_EN  (via drill 0.25)
  Top 0.254: U1.22 35.73,14.88 v36.6,15.75 | U10.P$1 R14.2 5.14,25.41 4.9,25.65 v4.9,25.91
  Route2 0.254: v31.5,27.69 30.99,27.69 30.23,28.45 30.23,29.97 29.79,30.4 20.9,30.4 20.57,30.73 v20.45,30.73 | v12.95,27.43 11.43,25.91 4.83,25.91 4.9,25.98 v4.9,25.91
  Route3 0.254: v36.6,15.75 37.21,16.36 37.21,19.68 36.83,20.07 35.81,20.07 34.8,21.08 34.8,26.92 34.04,27.69 v31.5,27.69
  Bottom 0.254: v12.95,27.43 12.95,29.59 14.4,31.04 19.94,31.04 20.24,30.73 v20.45,30.73
PWR_RADIO_EN  (via drill 0.25)
  Top 0.254: 22.24,11.2 21.21,11.2 | 21.21,11.2 U9.P$1 | U1.27 36.47,17.38 v36.58,17.27 | v21.23,10.44 21.23,11.17 21.21,11.2
  Top 0.305: 22.24,11.2 arc-90 R13.2
  Route2 0.254: v36.58,17.27 36.83,17.02 41.91,17.02 43.43,15.24 53.55,15.24 H1.B30
  Bottom 0.254: v21.23,10.44 21.23,10.57 22.05,11.38 26.16,11.38 26.36,11.18 33.78,11.18 34.42,11.81 34.42,16.13 35.56,17.27 v36.58,17.27
PWR_SENSE_EN  (via drill 0.25)
  Top 0.254: U1.26 35.95,16.88 v36.32,16.51 | v19.3,0.51 U12.5
  Route2 0.254: v36.32,16.51 41.66,16.51 43.18,14.73 50.55,14.73 51.05,14.22 51.05,13.72 51.82,12.7 53.85,12.7 54.61,11.94 H1.B32 55.63,11.64 | 55.63,11.64 55.63,14.61 54.48,15.75 53.85,15.75 53.09,16.51 53.09,18.24 H1.B25 | 55.63,11.64 55.63,3.3 53.85,1.52 41.15,1.52 40.13,0.51 v19.3,0.51
RADIO_GPIO0  (via drill 0.25)
  Top 0.203: U1.51 23.09,13.88 v23.09,13.79
  Top 0.254: U2.10 4.85,14.5 2.97,16.38 2.97,18.69 2.46,19.2 R2.2 R2.1 2.46,22.28 3.81,23.62 v4.83,23.62
  Route2 0.254: v23.09,13.79 23.01,13.72 22.56,13.72 20.57,15.7 20.57,21.58 17.52,24.64 5.84,24.64 v4.83,23.62 | H1.C54 21.59,1.52 22.61,2.54 28.19,2.54 v28.32,2.41
  Route3 0.254: v23.09,13.79 22.86,13.56 22.86,12.95 24.64,11.18 24.64,10.16 25.65,9.14 25.65,3.3 25.91,3.05 27.43,3.05 28.07,2.41 v28.32,2.41
RADIO_GPIO2  (via drill 0.25)
  Top 0.203: v28.57,9.53 28.72,9.67 U1.5
  Top 0.254: U2.4 8.05,16.79 8.38,17.12 8.38,18.64 7.85,19.18 7.85,19.7 R6.2 | 7.54,19.76 7.62,19.58 | 7.54,19.76 R6.1 v7.54,21.77 | R6.2 7.54,19.76 | 7.54,19.48 R6.2
  Route2 0.254: H1.C42 35.53,1.48 v35.36,1.66 | v7.54,21.77 7.62,21.84 16.92,21.84 18.54,20.22 18.54,14.48 21.34,11.68 23.11,11.68 25.4,9.4 28.45,9.4 v28.57,9.53 34.29,9.53 35.05,8.76 v35.31,8.76
  Route3 0.254: v35.31,8.76 35.31,1.71 v35.36,1.66
RADIO_RESET_N  (via drill 0.25)
  Top 0.203: v28.96,8.89 29.22,9.16 U1.6
  Top 0.254: U2.2 9.04,19.46 8.81,19.48 R7.2 R7.1 9.03,21.21 v13.46,21.21
  Route2 0.254: v33.93,8.74 33.78,8.89 v28.96,8.89 25.15,8.89 22.86,11.18 21.08,11.18 18.03,14.22 18.03,19.9 16.6,21.34 13.46,21.34 v13.46,21.21
  Route3 0.254: v33.93,8.74 34.04,8.64 34.04,4.27 H1.C43
RADIO_SPI_CLK  (via drill 0.25)
  Top 0.203: U1.53 24.11,12.88 v24.05,12.83
  Top 0.254: U2.8 6.04,16.03 5.84,16.23 4.62,16.23 3.99,16.87 3.99,18.19 4.75,18.95 4.75,19.46 R4.2 R4.1 v5,21.84
  Route2 0.254: H1.B34 53.64,8.13 41.4,8.13 38.35,11.18 36.32,11.18 35.81,10.67 26.8,10.67 26.16,11.3 25.53,11.3 25.15,11.68 25.15,12.57 24.84,12.88 24.05,12.88 v24.05,12.83 23.93,12.7 21.9,12.7 19.56,15.04 19.56,20.92 16.86,23.62 6.78,23.62 v5,21.84
RADIO_SPI_CSN  (via drill 0.25)
  Top 0.203: U1.50 23.11,14.38
  Top 0.254: U2.11 4.7,14.02 2.46,16.26 2.46,17.86 1.2,19.12 R1.2 R1.1 1.2,21.77 v1.27,21.84 | 23.11,14.38 v23.09,14.45
  Route2 0.254: v23.09,14.45 23.06,14.48 22.52,14.48 21.08,15.91 21.08,21.89 17.83,25.15 4.83,25.15 v1.27,21.84
  Route3 0.254: H1.C48 28.24,1.48 27.18,2.54 25.65,2.54 25.15,3.05 25.15,8.89 24.13,9.91 24.13,10.92 22.35,12.7 22.35,13.97 22.84,14.45 v23.09,14.45
RADIO_SPI_MISO  (via drill 0.25)
  Top 0.203: U1.52 23.6,13.38 v23.57,13.31
  Top 0.254: 5.03,15.01 U2.9 5.13,15.01 3.48,16.66 3.48,18.96 3.73,19.22 R3.2 R3.1 3.73,21.51 v4.06,21.84
  Route2 0.254: v23.57,13.31 23.47,13.21 22.22,13.21 20.07,15.36 20.07,21.23 17.17,24.13 6.35,24.13 v4.06,21.84 | H1.B40 54.06,4.02 52.83,3.05 41.15,3.05 40.64,2.54 31.24,2.54 31.11,2.41 v30.73,2.41
  Route3 0.254: v30.73,2.41 30.73,4.06 27.94,6.86 27.94,9.4 27.18,10.16 25.4,10.16 25.15,10.41 25.15,12.95 24.72,13.38 23.64,13.38 v23.57,13.31
RADIO_SPI_MOSI  (via drill 0.25)
  Top 0.203: U1.54 24.57,12.38 v24.51,12.27
  Top 0.254: U2.7 6.55,16.38 6.2,16.74 4.83,16.74 4.5,17.07 4.5,17.98 5.41,18.9 5.94,18.9 6.27,19.23 R5.2 R5.1 6.27,21.77 v6.35,21.84
  Route2 0.254: H1.B36 53.55,7.62 41.15,7.62 38.1,10.67 36.58,10.67 36.07,10.16 25.4,10.16 24.51,11.05 v24.51,12.27 24.38,12.19 21.59,12.19 19.05,14.73 19.05,20.56 17.25,22.35 6.86,22.35 v6.35,21.84
RGND  (via drill 0.25)
  Top 0.254: 14.99,18.24 14.99,18.03 14.48,17.52 | 14.48,17.52 14.37,17.41 | X1.4 14.48,17.44 14.48,17.52 | X1.2 13.13,15.99 13.13,15.96 | 14.28,18.59 C311.2 | C301.2 15.47,18.59 | C302.2 16.38,17.75 16.41,17.78 | 11.23,17.04 11.18,17.04 11.18,15.62 10.56,15 U2.32 | 11.28,17.09 11.33,17.14 11.28,17.14 R12.1 11.28,18.16 | 11.28,17.09 11.23,17.04 | 11.28,17.04 11.23,17.04 | R12.2 11.28,17.09 | 10.85,18.67 10.16,18.67 C11.2 11.22,18.11 arc-90 11.3,18.03 11.3,18.16 11.28,18.16 | 11.28,18.16 11.28,18.67 | 11.28,18.67 10.85,18.67 | 10.85,18.67 v9.68,18.8 10.72,18.8 10.72,18.14 | 12.14,18.67 11.28,18.67
  Top 0.304: 13.22,15.96 13.13,15.96 12.51,15.96 12.22,15.67 | 16.41,17.55 16.41,17.78 16.41,18.29 16.1,18.59 16.08,18.59 | 14.99,18.59 14.28,18.59 | 14.99,18.59 14.99,18.24 | 15.14,18.59 14.99,18.59
  Top 0.305: C151.2 1.65,11.25 1.65,12.12 | 1.65,12.12 R141.1 | C131.2 1.8,12.98 1.8,12.88 1.65,12.88 1.65,12.12 | C171.2 1.9,9.22 1.45,9.68 1.45,10.06 | 1.45,10.06 1.45,11.43 v1.63,11.61 | 1.53,10.14 1.45,10.06 | 12.22,15.67 12.22,15.62 v12.24,15.62 | C172.2 1.67,10.14 v1.63,10.19 | C51.2 7.2,18.69 6.5,18.69 6.07,18.26 v5.89,18.26
  Top 0.406: C121.2 1.98,14.38 1.6,14.76 v0.58,14.66 | 10.19,18.06 10.16,18.09 C11.2
  Top 0.508: 16.08,18.59 15.47,18.59 15.14,18.59
  Bottom 0.254: 0.43,13.99 0.43,10.49 0.74,10.19 v1.63,10.19
  other vias: 1.63,9.25 3.45,6.02 5.05,5.92 8.08,5.92 10.95,6.02 5.18,10.21 1.63,12.67 15.34,18.64 16.41,18.64 15.62,5.46 16.48,2.82 14.2,2.82 15.47,2.82 15.47,1.55 14.2,1.55 12.93,1.55 16.48,1.55 14.2,4.09 12.93,4.09 12.93,5.36 12.93,2.82 12.93,6.63 16.48,0.51 15.47,0.51 14.2,0.51 12.93,0.51 14.2,9.17 14.2,10.44 12.93,7.9 12.93,9.17 11.66,9.17 11.66,7.9 11.66,6.63 14.2,11.71 15.47,12.98 16.48,12.98 9.12,6.63 10.39,6.63 9.68,6.02 12.22,6.02 2.18,6.02 4.52,9.55 5.41,8.74 8.15,8.74 5.41,7.21 8.15,7.21 16.26,11.96 16.26,10.69 16.26,9.42 16.26,8.38 15.47,13.84 16.48,13.84 14.45,13.84 0.58,15.93 0.58,17.2 0.58,18.47 1.6,17.2 1.6,15.93 0.58,10.59 0.58,9.07 0.58,7.54 0.58,6.02 1.63,8.23 1.63,7.21
  pour Route2 (isolate 0.254, rank 2): -2.29,-0.25 -2.16,20.09 9.19,20.09 9.19,18.9 16.64,18.9 16.59,-0.25
  pour Top (isolate 0.203): 4.98,9.75 4.98,5.79 8.38,5.79 8.38,9.75
  pour Top (isolate 0.254, rank 2): -1.02,-0.25 -0.89,20.09 9.19,20.09 9.19,18.9 16.64,18.9 16.59,-0.25
  pour Route3 (isolate 0.254, rank 2): -3.56,-0.25 -3.43,20.09 9.19,20.09 9.19,18.9 16.64,18.9 16.59,-0.25
  pour Bottom (isolate 0.254, rank 2): -4.83,-0.25 -4.7,20.09 9.19,20.09 9.19,18.9 16.64,18.9 16.59,-0.25
RS485_TXEN  (via drill 0.25)
  Top 0.254: U1.25 35.44,16.38 35.81,16 v35.81,15.88
  Route3 0.254: H1.C46 32.7,0.53 35.51,0.53 35.94,0.96 35.94,11.81 35.59,12.17 35.59,15.27 35.81,15.49 v35.81,15.88
RVDD  (via drill 0.25)
  Top 0.254: U2.5 7.54,17.33 C51.1 7.56,17.34 v6.82,18.06 | 3.58,8.26 R171.1 | U2.22 8.56,10.47 8.55,10.46 8.56,9.98 8.56,9.95 9.83,8.67 C221.1 9.86,8.36 | 9.7,8.33 9.86,8.36 | U2.25 10.62,11.51 11.43,10.69 C251.1 11.61,10.74 v10.59,10.74 | U2.27 11.94,12.5 C271.1 | 4,11.25 4.78,12.03 5.03,12.03 5.03,12.01 U2.15 | 4,11.25 4.14,11.25 v4.47,10.92 | C151.1 3.61,11.25 | C151.1 3.53,11.25 | 4,11.25 C151.1 | U2.13 3.63,13.01 C131.1 3.66,12.98 3.66,13.16 3.12,13.69 1.68,13.69 1.14,13.66 v1.32,13.79 | U2.12 4.37,13.51 3.5,14.38 C121.1 3.3,14.68 2.72,15.27 v2.39,15.27 | 13.08,13.13 12.57,13.64 12.57,13.77 | 13.08,13.13 13.89,13.13 v14.12,12.9 | 13.08,13.13 12.5,13.13 12.06,12.7 | 12.06,12.7 11.94,12.57 | 12.57,13.77 12.09,13.77 11.33,13.01 10.56,13 U2.28 | C281.1 12.57,13.77 | 9.55,16.02 | 10.2,16.57 10.16,16.61 C11.1 | 10.2,16.57 v10.59,16.18 | v10.59,7.77 10.13,8.23 9.86,8.23 | 9.55,16.02 9.55,16.08 10.05,16.57 10.2,16.57 | 12.57,13.77 C281.1 | C271.1 11.94,12.42 | C271.1 11.94,12.7 12.06,12.7 | 9.86,8.36 9.86,8.23 | 9.86,8.23 9.83,8.23 | C172.1 | 9.55,16.02 U2.1
  Top 0.305: C173.2 R171.1 | C172.1 C171.1 3.58,8.26 | v4.47,10.92 4.47,10.52 4.09,10.13 C172.1 | L1.2 16,7.02 | v14.12,12.9 14.13,12.91 | 14.58,7.29 C5.1
  Top 0.406: 16,7.02 C5.1 | v14.12,12.9 15.09,11.94 15.09,7.8 14.58,7.29
  Bottom 0.254: v14.12,12.9 14.12,12.6 13.95,12.42 | v6.82,18.06 6.69,17.98
  Bottom 0.305: v10.59,16.18 10.59,12.42 | 10.59,12.42 v10.59,10.74 | 13.95,12.42 10.59,12.42 | v10.59,7.77 v10.59,10.74 | v10.59,10.74 10.41,10.92 v4.47,10.92 1.22,10.92 0.94,11.2 0.94,13.41 v1.32,13.79 1.32,14.94 1.65,15.27 v2.39,15.27 2.39,17.13 2.76,17.5 6.45,17.5 6.69,17.74 6.69,17.98
SD_BUF_CLK  (via drill 0.25)
  Top 0.254: U11.12 1.63,31.85 0.38,30.61 0.38,25.53 0.96,24.94 v1.35,24.94
  Bottom 0.254: SD1.5 v1.35,24.94
SD_BUF_CSN  (via drill 0.25)
  Top 0.254: v1.52,32.49 U11.11
  Bottom 0.254: SD1.2 1.73,28.24 1.27,28.7 1.27,32.23 v1.52,32.49
SD_BUF_MISO  (via drill 0.25)
  Top 0.254: U11.13 1.73,31.19 0.84,30.3 0.84,25.88 1.07,25.65 1.52,25.65 2.03,25.15 2.03,24.38 1.27,23.62 v1.27,23.24
  Bottom 0.254: SD1.7 1.64,22.74 1.27,23.11 v1.27,23.24
SD_BUF_MOSI  (via drill 0.25)
  Top 0.254: U11.14 1.85,30.56 1.29,30 1.29,27.13 v1.42,27.13
  Bottom 0.254: SD1.3 1.35,27.14 v1.42,27.13
SD_SPI_CLK  (via drill 0.25)
  Top 0.203: U1.9 30.72,7.86 30.48,7.62 v30.23,7.62
  Top 0.254: U11.5 v7.62,31.85 | v13.08,20.57 14.1,20.57 15.36,21.84 U8.6
  Route2 0.254: v30.23,7.62 29.72,8.13 v24.51,8.13
  Route3 0.254: v7.62,31.85 8.41,31.85 9.4,30.86 9.4,23.81 12.63,20.57 v13.08,20.57 13.08,20.45 13.59,20.45 14.35,21.21 19.48,21.21 20.7,19.99 20.7,13.56 22.86,11.4 22.86,8.89 23.62,8.13 v24.51,8.13 | H1.C45 31.79,4.02 30.23,5.59 v30.23,7.62
SD_SPI_CSN  (via drill 0.25)
  Top 0.203: U1.23 34.68,15.38 v35.05,15.75
  Top 0.254: U11.6 v7.11,32.49
  Route3 0.254: v35.05,15.75 35.05,17.27 32,20.32 30.73,20.32 29.59,19.18 21.72,19.18 21.21,19.68 21.21,20.22 19.58,21.84 12.09,21.84 9.91,24.03 9.91,31.24 8.66,32.49 v7.11,32.49
SD_SPI_MISO  (via drill 0.25)
  Top 0.203: U1.7 29.72,8.77 28.7,7.75 v28.7,6.99
  Top 0.254: H1.C52 25.15,2.5 25.15,4.57 24.13,5.59 v24.13,6.6 | U11.4 7.62,31.19 v6.99,30.56 | v12.31,23.02 12.24,23.07 U8.2
  Route2 0.254: v24.13,6.6 25.15,6.6 25.65,7.11 28.57,7.11 v28.7,6.99
  Route3 0.254: v6.99,30.56 7.87,30.56 8.38,30.05 8.38,23.11 v11.68,19.81 12.32,19.18 13.84,19.18 14.86,20.19 18.95,20.19 19.68,19.46 19.68,12.95 21.84,10.79 21.84,8.38 23.62,6.6 v24.13,6.6
  Bottom 0.254: v11.68,19.81 12.31,20.44 v12.31,23.02
SD_SPI_MOSI  (via drill 0.25)
  Top 0.203: U1.8 30.22,8.64 29.36,7.78 v29.36,7.47
  Top 0.254: U1.8 | H1.C50 25.65,2.5 25.65,4.83 24.77,5.71 24.77,6.99 24.38,7.37 v24.13,7.37 | U11.3 7.95,30.56 7.37,29.97 6.43,29.97 6.25,30.15 v6.25,30.61 | v13.08,19.81 14.55,19.81 15.35,20.61 U8.5
  Route2 0.254: v24.13,7.37 25.15,7.37 25.4,7.62 29.36,7.62 v29.36,7.47
  Route3 0.254: v24.13,7.37 23.62,7.37 22.35,8.64 22.35,11.07 20.19,13.23 20.19,19.71 19.2,20.7 14.61,20.7 13.72,19.81 v13.08,19.81 12.67,19.81 8.89,23.59 8.89,30.48 8.18,31.19 6.55,31.19 6.25,30.81 v6.25,30.61
TEMP_ALERT  (via drill 0.25)
  Top 0.254: U12.3 v18.8,4.06
  Bottom 0.254: v18.8,4.06 19.68,4.95 29.84,4.95 30.23,4.57 30.23,3.56 30.73,3.05 35.86,3.05 H1.C41
UART0_RX  (via drill 0.25)
  Top 0.254: U4.25 48.99,20.66 49.84,19.81 49.84,7.32 50.59,6.56 H1.B35 | U1.16 34.86,11.88 v35.05,11.68
  Route2 0.254: H1.C47 29.21,4.57 30.23,5.59 34.16,5.59 v34.67,5.08 50.59,5.08 H1.B35
  Route3 0.254: v35.05,11.68 35.05,11.43 34.67,11.05 v34.67,5.08
UART0_TX  (via drill 0.25)
  Top 0.254: U4.24 48.81,20.15 49.33,19.63 49.33,4.78 50.08,4.02 H1.B37 | U1.17 35.37,12.38 35.94,11.81 v36.73,11.81
  Route2 0.254: 37.59,3.05 40.39,3.05 41.15,3.81 51.86,3.81 H1.B37 | 37.59,3.05 22.56,3.05 H1.C53 | v37.59,3.17 37.62,3.07 37.59,3.05
  Route3 0.254: v37.59,3.17 37.85,3.43 37.85,5.08 38.35,5.59 38.86,5.59 39.37,6.1 39.37,9.73 37.29,11.81 v36.73,11.81
UART1_RX  (via drill 0.25)
  Top 0.254: U1.13 32.72,7.92 33.15,7.49 v33.4,7.49
  Route2 0.254: v47.5,6.35 46.99,6.35 46.74,6.6 40.64,6.6 39.62,7.62 33.53,7.62 v33.4,7.49
  Route3 0.254: H1.B31 51.05,10.62 51.05,8.64 50.29,7.87 48.51,7.87 47.75,7.11 47.75,6.6 v47.5,6.35
UART1_TX  (via drill 0.25)
  Top 0.254: U1.14 33.22,8.31 v33.33,8.26
  Route2 0.254: v48.51,6.86 48.26,7.11 40.89,7.11 37.85,10.16 36.83,10.16 36.07,9.4 36.07,8.48 35.71,8.13 33.33,8.13 v33.33,8.26
  Route3 0.254: H1.B33 52.07,8.89 50.55,7.37 48.77,7.37 48.51,7.11 v48.51,6.86
USB_D_N  (via drill 0.25)
  Top 0.254: U3.3 47.19,26.62 46.39,25.81 v45.74,25.81
  Top 0.305: J1.2 45.57,30.36 45.59,25.96 v45.74,25.81 | U4.4 45.54,24.21 v45.39,24.36
  Route3 0.305: H1.B21 52.07,25.1 51.01,26.16 46.09,26.16 v45.74,25.81 45.72,24.7 v45.39,24.36
USB_D_P
  Top 0.305: J1.3 45.01,30.35 45.01,25.43 45.36,25.08 45.72,25.08 46.05,24.75 | U3.5 51.32,27.63 H1.B19 51.23,26.04 47.35,26.04 46.54,25.23 46.53,25.23 46.05,24.75 | U4.3 46.05,24.75
USER_BUTTON  (via drill 0.25)
  Top 0.254: U7.6 46.15,13.84 45.33,13.84 44.68,13.19 44.68,12.83 | 44.68,12.83 44.68,5.21 | 44.68,5.21 44.68,3.94 | 44.68,3.94 44.68,0.85 | 45.88,0.85 USR.5 44.68,0.85 | 44.68,0.85 USR.1 arc-90 40.59,0.51 35.26,0.51 H1.C44 | C15.1 44.26,5.21 44.68,5.21 | 44.68,0.85 44.69,0.86 44.7,1.04 | U1.19 36.4,13.38 v36.58,13.21 | R19.1 41.01,3.94 44.68,3.94 | 44.68,12.83 v44.07,12.83
  Route2 0.254: v36.58,13.21 43.69,13.21 v44.07,12.83

## Text on the board
tPlace: University of Southampton | 2.4G | Muntjac | 1.0 | ANT | April 2016 | 868MHz
bPlace: Southampton | University of | ECS | Phil Basford | Graeme Bragg